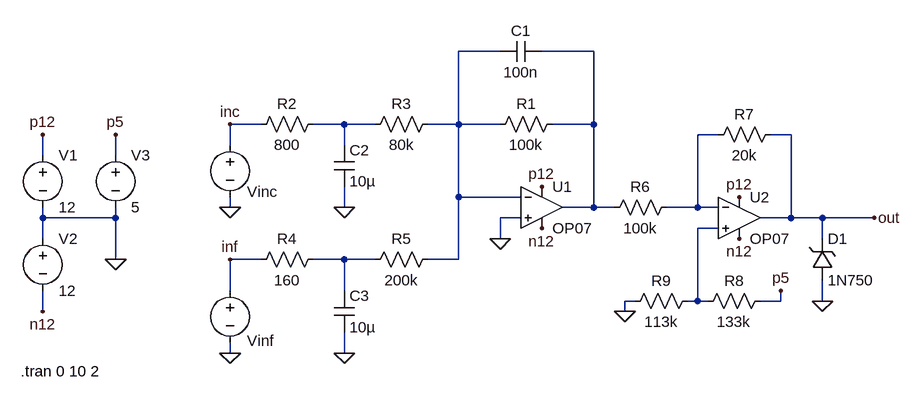
[diagram p0: schematic Simulation.asc]
Simulation.asc, the LTspice schematic file:
Version 4
SHEET 1 1028 824
WIRE 16 -16 -48 -16
WIRE 160 -16 80 -16
WIRE -352 96 -400 96
WIRE -224 96 -272 96
WIRE -176 96 -224 96
WIRE -48 96 -48 -16
WIRE -48 96 -96 96
WIRE 16 96 -48 96
WIRE 160 96 160 -16
WIRE 160 96 96 96
WIRE 352 112 320 112
WIRE 464 112 432 112
WIRE -400 128 -400 96
WIRE -224 128 -224 96
WIRE -688 144 -688 112
WIRE -576 144 -576 112
WIRE -48 208 -48 96
WIRE 48 208 -48 208
WIRE -400 224 -400 208
WIRE -224 224 -224 192
WIRE 160 224 160 96
WIRE 160 224 112 224
WIRE 192 224 160 224
WIRE 320 224 320 112
WIRE 320 224 272 224
WIRE 352 224 320 224
WIRE -688 240 -688 224
WIRE -576 240 -576 224
WIRE -576 240 -688 240
WIRE 48 240 16 240
WIRE 464 240 464 112
WIRE 464 240 416 240
WIRE 512 240 464 240
WIRE 592 240 512 240
WIRE 352 256 320 256
WIRE -688 272 -688 240
WIRE 16 272 16 240
WIRE 512 272 512 240
WIRE -576 304 -576 240
WIRE -352 304 -400 304
WIRE -224 304 -272 304
WIRE -176 304 -224 304
WIRE -48 304 -48 208
WIRE -48 304 -96 304
WIRE -400 352 -400 304
WIRE -224 352 -224 304
WIRE 224 368 208 368
WIRE 320 368 320 256
WIRE 320 368 304 368
WIRE 336 368 320 368
WIRE 448 368 448 352
WIRE 448 368 416 368
WIRE 512 368 512 336
WIRE -688 384 -688 352
WIRE 208 384 208 368
WIRE -400 448 -400 432
WIRE -224 448 -224 416
FLAG -576 304 0
FLAG -688 384 n12
FLAG -688 112 p12
FLAG -576 112 p5
FLAG 448 352 p5
FLAG 208 384 0
FLAG 512 368 0
FLAG -224 224 0
FLAG -224 448 0
FLAG 16 272 0
FLAG 80 256 n12
FLAG 80 192 p12
FLAG 384 208 p12
FLAG -400 448 0
FLAG -400 224 0
FLAG -400 96 inc
FLAG 592 240 out
FLAG -400 304 inf
FLAG 384 272 n12
SYMBOL res 112 80 R90
WINDOW 0 0 56 VBottom 2
WINDOW 3 32 56 VTop 2
SYMATTR InstName R1
SYMATTR Value 100k
SYMBOL res -256 80 R90
WINDOW 0 0 56 VBottom 2
WINDOW 3 32 56 VTop 2
SYMATTR InstName R2
SYMATTR Value 800
SYMBOL res -80 80 R90
WINDOW 0 0 56 VBottom 2
WINDOW 3 32 56 VTop 2
SYMATTR InstName R3
SYMATTR Value 80k
SYMBOL res -256 288 R90
WINDOW 0 0 56 VBottom 2
WINDOW 3 32 56 VTop 2
SYMATTR InstName R4
SYMATTR Value 160
SYMBOL res -80 288 R90
WINDOW 0 0 56 VBottom 2
WINDOW 3 32 56 VTop 2
SYMATTR InstName R5
SYMATTR Value 200k
SYMBOL res 288 208 R90
WINDOW 0 0 56 VBottom 2
WINDOW 3 32 56 VTop 2
SYMATTR InstName R6
SYMATTR Value 100k
SYMBOL res 448 96 R90
WINDOW 0 0 56 VBottom 2
WINDOW 3 32 56 VTop 2
SYMATTR InstName R7
SYMATTR Value 20k
SYMBOL res 432 352 R90
WINDOW 0 0 56 VBottom 2
WINDOW 3 32 56 VTop 2
SYMATTR InstName R8
SYMATTR Value 133k
SYMBOL res 320 352 R90
WINDOW 0 0 56 VBottom 2
WINDOW 3 32 56 VTop 2
SYMATTR InstName R9
SYMATTR Value 113k
SYMBOL cap -240 128 R0
SYMATTR InstName C2
SYMATTR Value 10µ
SYMBOL cap -240 352 R0
SYMATTR InstName C3
SYMATTR Value 10µ
SYMBOL Opamps\\OP07 80 160 R0
SYMATTR InstName U1
SYMBOL Opamps\\OP07 384 176 R0
SYMATTR InstName U2
SYMBOL voltage -688 128 R0
SYMATTR InstName V1
SYMATTR Value 12
SYMBOL voltage -688 256 R0
SYMATTR InstName V2
SYMATTR Value 12
SYMBOL voltage -576 128 R0
SYMATTR InstName V3
SYMATTR Value 5
SYMBOL zener 496 336 M180
WINDOW 0 24 64 Left 2
WINDOW 3 24 0 Left 2
SYMATTR InstName D1
SYMATTR Value 1N750
SYMATTR Description Diode
SYMATTR Type diode
SYMBOL voltage -400 112 R0
WINDOW 0 26 88 Left 2
WINDOW 3 24 96 Invisible 2
WINDOW 123 0 0 Left 0
WINDOW 39 0 0 Left 0
SYMATTR InstName Vinc
SYMATTR Value SINE(0 3 50)
SYMBOL voltage -400 336 R0
WINDOW 0 26 93 Left 2
WINDOW 3 24 96 Invisible 2
WINDOW 123 0 0 Left 0
WINDOW 39 0 0 Left 0
SYMATTR InstName Vinf
SYMATTR Value SINE(0 10 1)
SYMBOL cap 80 -32 R90
WINDOW 0 0 32 VBottom 2
WINDOW 3 32 32 VTop 2
SYMATTR InstName C1
SYMATTR Value 100n
TEXT -722 476 Left 2 !.tran 0 10 2

The netlist it stands for:
* Simulation.asc
R1 N002 N001 100k
R2 N003 inc 800
R3 N001 N003 80k
R4 N006 inf 160
R5 N001 N006 200k
R6 N004 N002 100k
R7 out N004 20k
R8 p5 N005 133k
R9 N005 0 113k
C2 N003 0 10µ
C3 N006 0 10µ
XU1 0 N001 p12 n12 N002 LT1001  ; OP07, pins In+ In- V+ V- OUT
XU2 N005 N004 p12 n12 out LT1001  ; OP07, pins In+ In- V+ V- OUT
V1 p12 0 12
V2 0 n12 12
V3 p5 0 5
D1 0 out 1N750
Vinc inc 0 SINE(0 3 50)
Vinf inf 0 SINE(0 10 1)
C1 N002 N001 100n
.model D D
.lib standard.dio
.tran 0 10 2
.lib LTC.lib
.backanno
.end